# Altium schematic sheet analog.SchDoc
size A; SheetNumber: 1; SheetTotal: 2
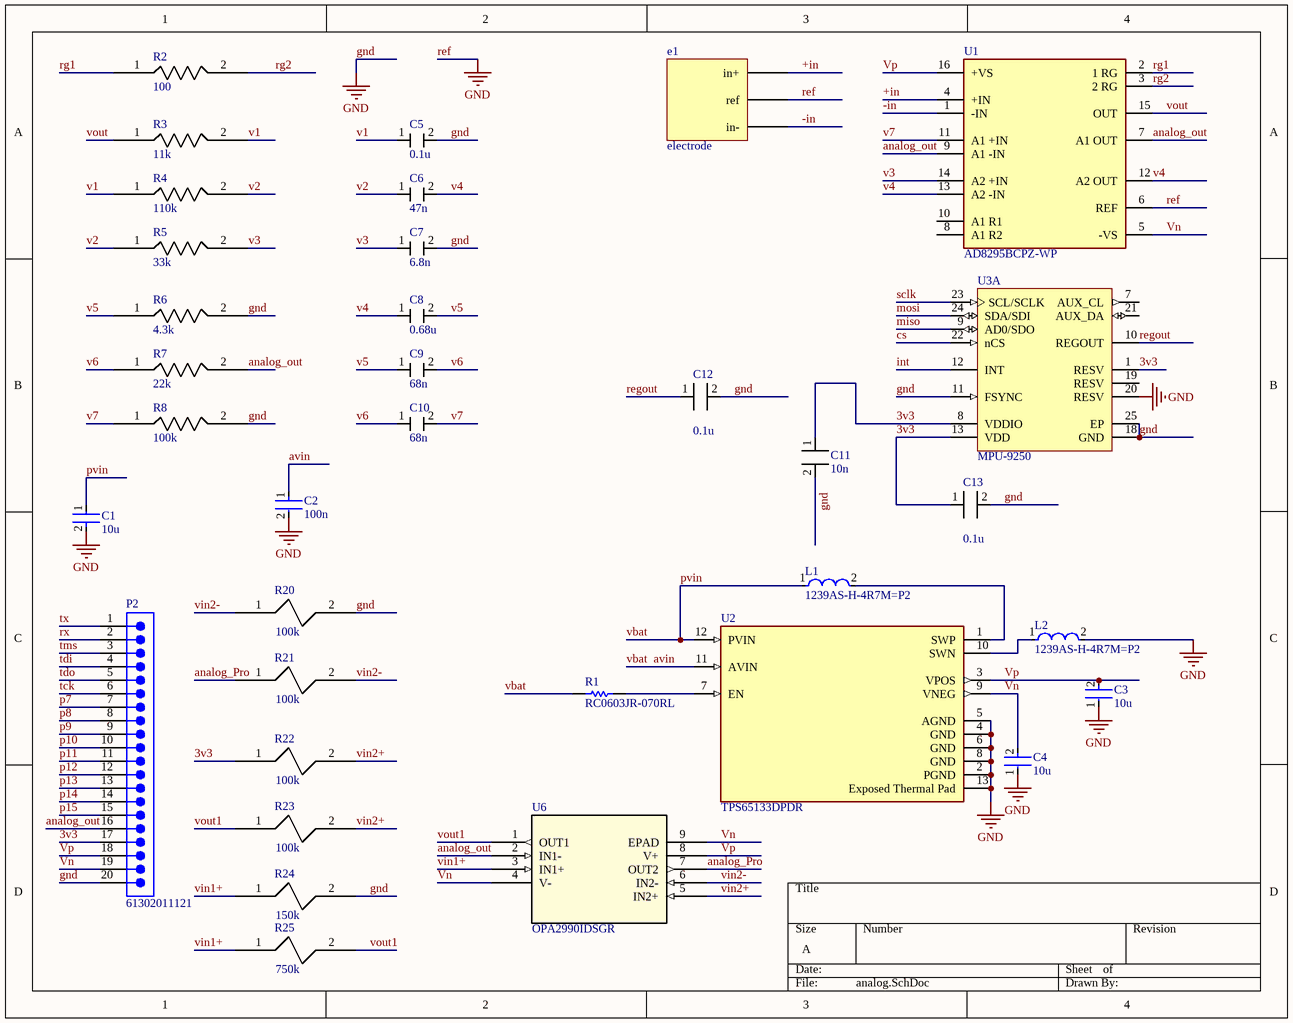
[diagram p0: analog.SchDoc]

## Parts
C1  10u  [FP-C1608-080-0_1-MFG]
C2  100n  [FP-CGA3E-0_3-0_1-IPC_A]
C3  10u  [FP-C1608-080-0_1-MFG]
C4  10u  [FP-C1608-080-0_1-MFG]
C5  C: 0.1u  [GeneralCap]  (hidden comment: genCap)
C6  C: 47n  [GeneralCap]  (hidden comment: genCap)
C7  C: 6.8n  [GeneralCap]  (hidden comment: genCap)
C8  C: 0.68u  [GeneralCap]  (hidden comment: genCap)
C9  C: 68n  [GeneralCap]  (hidden comment: genCap)
C10  C: 68n  [GeneralCap]  (hidden comment: genCap)
C11  C: 10n  [GeneralCap]  (hidden comment: genCap)
C12  C: 0.1u  [GeneralCap]  (hidden comment: genCap)
C13  C: 0.1u  [GeneralCap]  (hidden comment: genCap)
e1  electrode  [electrode]
L1  1239AS-H-4R7M=P2  [FP-DFE252012C-IPC_A]
L2  1239AS-H-4R7M=P2  [FP-DFE252012C-IPC_A]
P2  61302011121  [61302011121]
R1  RC0603JR-070RL  [RESC1608X55X25ML10T15]
R2  R: 100  [GeneralCap]  (hidden comment: genRes)
R3  R: 11k  [GeneralCap]  (hidden comment: genRes)
R4  R: 110k  [GeneralCap]  (hidden comment: genRes)
R5  R: 33k  [GeneralCap]  (hidden comment: genRes)
R6  R: 4.3k  [GeneralCap]  (hidden comment: genRes)
R7  R: 22k  [GeneralCap]  (hidden comment: genRes)
R8  R: 100k  [GeneralCap]  (hidden comment: genRes)
R20  R: 100k  [GeneralCap]  (hidden comment: genRes)
R21  R: 100k  [GeneralCap]  (hidden comment: genRes)
R22  R: 100k  [GeneralCap]  (hidden comment: genRes)
R23  R: 100k  [GeneralCap]  (hidden comment: genRes)
R24  R: 150k  [GeneralCap]  (hidden comment: genRes)
R25  R: 750k  [GeneralCap]  (hidden comment: genRes)
U1  AD8295BCPZ-WP  [FP-CP-16-19-IPC_C]
U2  TPS65133DPDR  [FP-DPD0012A-MFG]
U3  MPU-9250  [INSE-QFN-24-1700X1540TP_M]  (part A of 2)
U6  OPA2990IDSGR  [WSON8_DSG_TEX]

## Nets
gnd: C1.2 C2.2 C3.1 C4.1 C5.2 C7.2 C11.2 C12.2 C13.2 e1.ref L2.2 P2.20 R6.2 R8.2 R20.2 R24.2 U1.6(REF) U2.2(PGND) U2.4(GND) U2.5(AGND) U2.6(GND) U2.8(GND) U2.13(Exposed_Thermal_Pad) U3.11(FSYNC) U3.18(GND) U3.20(RESV) U3.25(EP)  [also labelled ref]
3v3: C11.1 C13.1 P2.17 R22.1 U3.1(RESV) U3.8(VDDIO) U3.13(VDD)
+in: e1.in+ U1.4(+IN)
-in: e1.in- U1.1(-IN)
analog_out: P2.16 R7.2 U1.7(A1_OUT) U1.9(A1_-IN) U6.2(IN1-)
analog_Pro: R21.1 U6.7(OUT2)
avin: C1.1 C2.1 L1.1 R1.1 U2.11(AVIN) U2.12(PVIN)  [also labelled pvin, vbat]
cs: U3.22(nCS)
int: U3.12(INT)
miso: U3.9(AD0/SDO)
mosi: U3.24(SDA/SDI)
p7: P2.7
p8: P2.8
p9: P2.9
p10: P2.10
p11: P2.11
p12: P2.12
p13: P2.13
p14: P2.14
p15: P2.15
regout: C12.1 U3.10(REGOUT)
rg1: R2.1 U1.2(1_RG)
rg2: R2.2 U1.3(2_RG)
rx: P2.2
sclk: U3.23(SCL/SCLK)
tck: P2.6
tdi: P2.4
tdo: P2.5
tms: P2.3
tx: P2.1
v1: C5.1 R3.2 R4.1
v2: C6.1 R4.2 R5.1
v3: C7.1 R5.2 U1.14(A2_+IN)
v4: C6.2 C8.1 U1.12(A2_OUT) U1.13(A2_-IN)
v5: C8.2 C9.1 R6.1
v6: C9.2 C10.1 R7.1
v7: C10.2 R8.1 U1.11(A1_+IN)
vin1+: R24.1 R25.1 U6.3(IN1+)
vin2+: R22.2 R23.2 U6.5(IN2+)
vin2-: R20.1 R21.2 U6.6(IN2-)
Vn: C4.2 P2.19 U1.5(-VS) U2.9(VNEG) U6.4(V-) U6.9(EPAD)
vout: R3.1 U1.15(OUT)
vout1: R23.1 R25.2 U6.1(OUT1)
Vp: C3.2 P2.18 U1.16(+VS) U2.3(VPOS) U6.8(V+)
NetL1_2: L1.2 U2.1(SWP)
NetL2_1: L2.1 U2.10(SWN)
NetR1_2: R1.2 U2.7(EN)

Not connected (* = marked no-connect by the designer): U1 8(A1_R2) 10(A1_R1); U3 7(AUX_CL) 19(RESV) 21(AUX_DA)

## Library data of the parts
C1 = CMP-2000-04979-3: C19702; Dielectric Material: Ceramic; Voltage Rating (DC): 10V; Tolerance: 10%; Dielectric: X5R; Capacitance: 10uF; Construction: Flat; Height: 0.8mm; Thickness: 0.035inch; Case Code (Metric): 1608; Radiation Hardening: No; Number of Pins: 2; Depth: 0.8mm; Voltage: 10V; RoHS Compliant: Yes; Voltage Rating: 10V; Package Quantity: 1; Resistor Type: Ceramic; Termination: SMD/SMT; Lead Free: Lead Free; REACH SVHC: No SVHC; Mount: Surface Mount; Series: C; Packaging: Tape and Reel; Width: 0.8mm; Weight: 7.1E-05oz; Length: 1.6mm; Max Operating Temperature: 85°C; Case Code (Imperial): 0603; Case/Package: 0603; Min Operating Temperature: -55°C
C2 = CMP-2000-07546-2: C14663; Dielectric: X7R; Tolerance: 10%; Voltage Rating: 50V; Capacitance: 100nF; Weight: 7.1E-05oz; Composition: Ceramic; Max Operating Temperature: 125°C; Termination: SMD/SMT; Length: 1.6mm; Package Quantity: 1; REACH SVHC: No SVHC; Lead Free: Lead Free; Case Code (Metric): 1608; Min Operating Temperature: -55°C; Packaging: Tape and Reel; Case Code (Imperial): 0603; Case/Package: 0603; Voltage Rating (DC): 50V; Depth: 0.8mm; Radiation Hardening: No; Ratings: AEC-Q200; Mount: Surface Mount; Voltage: 50V; Thickness: 0.035inch; Width: 0.8mm; Height: 0.8mm
C3 C4 = CMP-2000-04979-3: C6119842; Dielectric Material: Ceramic; Voltage Rating (DC): 10V; Tolerance: 10%; Dielectric: X5R; Capacitance: 10uF; Construction: Flat; Height: 0.8mm; Thickness: 0.035inch; Case Code (Metric): 1608; Radiation Hardening: No; Number of Pins: 2; Depth: 0.8mm; Voltage: 10V; RoHS Compliant: Yes; Voltage Rating: 10V; Package Quantity: 1; Resistor Type: Ceramic; Termination: SMD/SMT; Lead Free: Lead Free; REACH SVHC: No SVHC; Mount: Surface Mount; Series: C; Packaging: Tape and Reel; Width: 0.8mm; Weight: 7.1E-05oz; Length: 1.6mm; Max Operating Temperature: 85°C; Case Code (Imperial): 0603; Case/Package: 0603; Min Operating Temperature: -55°C
C5 C12 C13 = genCap: C14663
C6 = genCap: C107093
C7 = genCap: C162241
C8 = genCap: C694504
C9 C10 = genCap: C107098
C11 = genCap: C100042
L1 L2 = CMP-06042-003985-1: C882976; Inductance: 4.7uH; Current Rating: 1.5A; Tolerance: 20%; Shielding: Shielded; Core Material: Ferrite; DC Resistance (DCR): 240mR; Test Frequency: 1MHz; Resistor Type: Wirewound; Mount: Surface Mount; Case/Package: 1008; Case Code (Metric): 2520; Width: 0.079inch; Min Operating Temperature: -40°C; Height - Seated (Max): 0.047inch; Length: 0.098inch; Max Operating Temperature: 85°C; Case Code (Imperial): 1008; Packaging: Tape and Reel
P2 = CMP-1502-01102-3: NexarPartId: 32855554; Operating Supply Voltage: 250V; Gender: Male; Current Rating: 3A; Contact Resistance: 20mΩ; Number of Contacts: 20; Pitch: 2.54mm; Connector Type: Male Pin; RoHS: Compliant; Contact Plating: Gold; REACH SVHC: Unknown; Packaging: Bulk; Lead Pitch: 2.54mm; Mount: Through Hole; Termination: Solder; Number of Pins: 20; Contact Mating Length: 5.9944mm; Number of Rows: 1; Color: Black; Contact Material: Copper; Orientation: Vertical; Number of Positions: 20
R1 = CMP-2100-03667-1: C95177; Manufacturer: Yageo; Temperature Coefficient: 200ppm/degreesC; Tolerance: 5%; Voltage Rating: 50V; Power Rating: 100mW; Resistance: 0mOhm; Width: 0.8mm; Max Operating Temperature: 155degC; Package Reference: 0603; Height: 0.45mm; Depth: 0.8mm; Package Description: 2-Pin Surface Mount Device, Body 1.6 x 0.8 mm; Termination: SMD/SMT; Package Quantity: 5000; Case/Package: 0603; Case Code (Imperial): 0603; Radiation Hardening: No; Number of Pins: 2; Length: 1.6mm; Lead Free: LeadFree; Voltage Rating (DC): 50V; Military Standard: Not; Datasheet URL: http://www.yageo.com/NewPortal/yageodocoutput?fileName=/pdf/R-Chip/PYu-RC_Group_51_RoHS_L_5.pdf; Manufacturer URL: http://www.yageo.com/; Packaging: TapeandReel; Case Code (Metric): 1608; Min Operating Temperature: -55degC; Composition: ThickFilm; RoHSCompliant: true; Contact Plating: Tin; Datasheet Version: Rev. 5, 10/2016; REACH SVHC: NoSVHC
R2 = genRes: C105588
R3 = genRes: C137801
R4 = genRes: C2906984
R5 = genRes: C4216
R6 = genRes: C2088918
R7 = genRes: C2907015
R8 R20-R23 = genRes: C14675
R24 = genRes: C2906993
R25 = genRes: C2849084
U1 = CMP-09116-000488-1: IC INST AMP 3 CIRCUIT 16LFCSP; Min Supply Voltage: 2.3V; Number of Circuits: 3; Nominal Supply Current: 2mA; Operating Supply Current: 2.3mA; Dual Supply Voltage: 9V; Max Dual Supply Voltage: 18V; Input Offset Voltage (Vos): 120uV; Common Mode Rejection Ratio: 140dB; Amplifier Type: INSTRUMENTATION AMPLIFIER; Output Current per Channel: 18mA; Input Bias Current: 800pA; Input Resistance: 100GR; Number of Amplifiers: 2; Slew Rate: 2V/µs; Gain Bandwidth Product: 1MHz; -3db Bandwidth: 1.2MHz; Voltage Gain: 60dB; Power Supply Rejection Ratio (PSRR): 150dB; Number of Elements: 1; Width: 4mm; Max Operating Temperature: 85°C; Supply Current: 2mA; Series: -; Height: 0.83mm; Case/Package: VQFN; Packaging: Waffle; Min Dual Supply Voltage: 2.3V; Mount: Surface Mount; Max Supply Voltage: 18V; Contact Plating: Tin; Min Operating Temperature: -40°C; Reach SVHC Compliant: Yes; Package Quantity: 64; Number of Channels: 3; Number of Pins: 16; Length: 4mm; Bandwidth: 1.2MHz; RoHS Compliant: Yes; Lead Free: Contains Lead
U2 = CMP-04918-000430-1: C134100; Number of Channels: 2; Max Supply Voltage: 5V; Min Supply Voltage: 2.9V; Output Voltage: -5V; Mount: Surface Mount; Case/Package: QFN; Packaging: Tape and Reel; Lead Free: Lead Free; Radiation Hardening: No; Min Operating Temperature: -40°C; Number of Outputs: 2; Max Operating Temperature: 85°C; Number of Pins: 12; RoHS Compliant: Yes; Package Quantity: 3000
U3 = CMP-2100-03657-1: 9-axis MotionTracking device, 2.4 to 3,6 V, -40 to 85 degC, 24-Pin QFN, RoHS, Tape and Reel; Manufacturer: InvenSense; Max Supply Voltage: 3.6V; Min Supply Voltage: 2.4V; Package Reference: QFN-24; Package Quantity: 1; Datasheet Version: Rev. 1.0, 01/2014; Case/Package: QFN; Package Description: 24-Pin Quad Flat No-lead Package, Body 3 x 3 mm, Pitch 0.4 mm; Datasheet URL: http://datasheet.octopart.com/MPU-9250-InvenSense-datasheet-21859386.pdf; RoHSCompliant: true; Max Operating Temperature: 85degC; Height: 1mm; Mount: SurfaceMount; Manufacturer URL: http://www.invensense.com/; Width: 3.1mm; Min Operating Temperature: -40degC; Length: 3.1mm
U6 = OPA2990IDSGR: C2057874; Mfr_Name: Texas Instruments; RefDes: RefDes; Type: Type